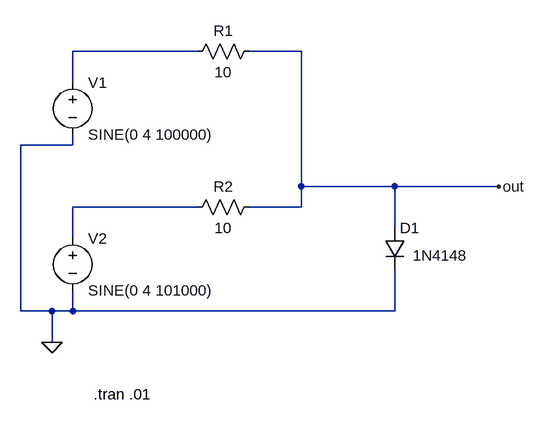
[diagram p0: schematic mixer1.asc]
mixer1.asc, the LTspice schematic file:
Version 4
SHEET 1 980 680
WIRE 400 96 208 96
WIRE 560 96 480 96
WIRE 208 144 208 96
WIRE 208 240 208 224
WIRE 208 240 128 240
WIRE 560 304 560 96
WIRE 704 304 560 304
WIRE 864 304 704 304
WIRE 400 336 208 336
WIRE 560 336 560 304
WIRE 560 336 480 336
WIRE 704 368 704 304
WIRE 208 384 208 336
WIRE 128 496 128 240
WIRE 176 496 128 496
WIRE 208 496 208 464
WIRE 208 496 176 496
WIRE 704 496 704 432
WIRE 704 496 208 496
WIRE 176 544 176 496
FLAG 176 544 0
FLAG 864 304 out
SYMBOL voltage 208 128 R0
SYMATTR InstName V1
SYMATTR Value SINE(0 4 100000)
SYMATTR SpiceLine Rser=50
SYMBOL voltage 208 368 R0
SYMATTR InstName V2
SYMATTR Value SINE(0 4 101000)
SYMATTR SpiceLine Rser=50
SYMBOL res 496 80 R90
WINDOW 0 0 56 VBottom 2
WINDOW 3 32 56 VTop 2
SYMATTR InstName R1
SYMATTR Value 10
SYMBOL res 496 320 R90
WINDOW 0 0 56 VBottom 2
WINDOW 3 32 56 VTop 2
SYMATTR InstName R2
SYMATTR Value 10
SYMBOL diode 688 368 R0
WINDOW 3 44 42 Left 2
SYMATTR InstName D1
SYMATTR Value 1N4148
TEXT 240 624 Left 2 !.tran .01

The netlist it stands for:
* mixer1.asc
V1 N001 0 SINE(0 4 100000) Rser=50
V2 N002 0 SINE(0 4 101000) Rser=50
R1 out N001 10
R2 out N002 10
D1 out 0 1N4148
.model D D
.lib standard.dio
.tran .01
.backanno
.end